# Altium schematic sheet CAN_MAX3051_NB2IND02.SchDoc: CAN Transceiver MAX3051
size A4; Organization: Altium Limited.; Address1: Level 3, 12a Rodborough Rd; Address2: Frenchs Forest 2086; Address3: NSW; Address4: AUSTRALIA; Revision: 6; SheetNumber: 1; SheetTotal: 100
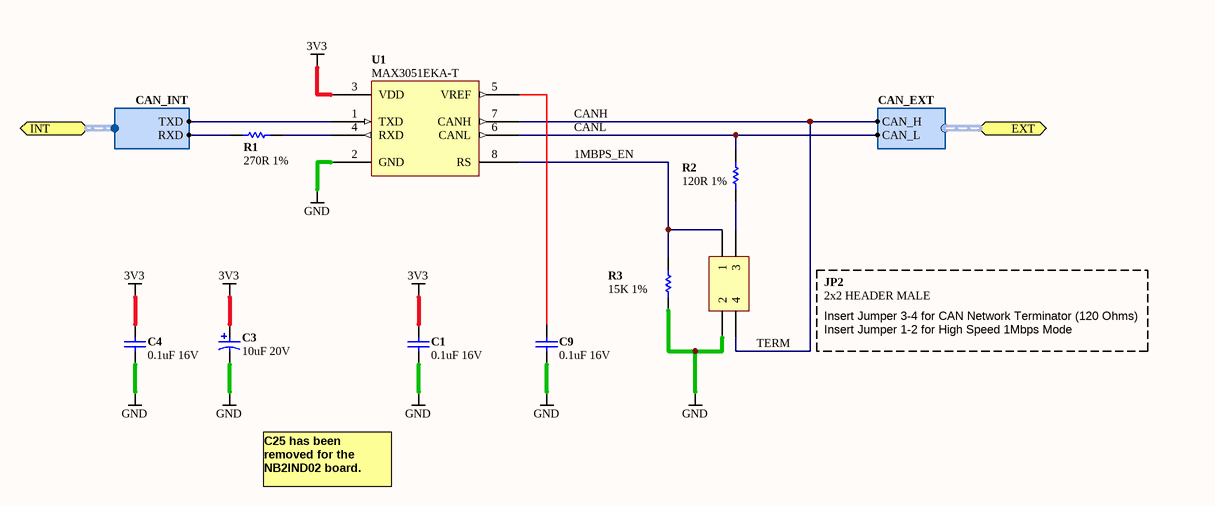
[diagram p0: CAN_MAX3051_NB2IND02.SchDoc]

## Parts
C1  0.1uF 16V  [CAPC1005-STAR]
C3  10uF 20V  [CAPC3528-STAR]
C4  0.1uF 16V  [CAPC1005-STAR]
C9  0.1uF 16V  [CAPC1005-STAR]
JP2  2x2 HEADER MALE  [HDR2X2]
R1  270R 1%  [RESC1005-STAR]
R2  120R 1%  [RESC1005-STAR]
R3  15K 1%  [RESC1005-STAR]
U1  MAX3051EKA-T  [SOT65P280-8]

## Ports
EXT (harness CAN_EXT), INT (harness CAN_INT)

## Harnesses
CAN_INT: TXD, RXD
CAN_EXT: CAN_H, CAN_L

## Nets
3V3: C1.1 C3.1 C4.1 U1.3(VDD)
GND: C1.2 C3.2 C4.2 C9.2 JP2.2 R3.1 U1.2(GND)
1MBPS_EN: JP2.1 R3.2 U1.8(RS)
CANH: JP2.4 U1.7(CANH) ; port EXT.CAN_H  [also labelled TERM]
CANL: R2.2 U1.6(CANL) ; port EXT.CAN_L
NetC9_1: C9.1 U1.5(VREF)
NetJP2_3: JP2.3 R2.1
NetR1_1: R1.1 ; port INT.RXD
NetR1_2: R1.2 U1.4(RXD)
NetU1_1: U1.1(TXD) ; port INT.TXD

## Notes on the sheet
- Insert Jumper 1-2 for High Speed 1Mbps Mode
- Insert Jumper 3-4 for CAN Network Terminator (120 Ohms)
- C25 has been removed for the NB2IND02 board.
- Sheet Title
- Project Title
- Size:
- Date:
- A4
- Assy:
- Time:
- Revision:
- Sheet
- of
- File:

## Library data of the parts
C1 C4 C9 = D-101-0080: Capacitor, Ceramic, 0.1uF 10% 16V 0402 (1005) X7R; Polarity: Non-Polarized; Category: Capacitor; Capacitance: 0.1 uF; Dielectric: X7R; Mounting Technology: Surface Mount; Rated Voltage: 16 V; Status: Production; Technology: Ceramic; Tolerance: 10 %
C3 = D-101-0007: Capacitor, Tantalum, 10uF 10% 20V MCCT-B (3528); Polarity: Polarized; Category: Capacitor; Capacitance: 10 uF; Mounting Technology: Surface Mount; Rated Voltage: 20 V; Status: Production; Technology: Tantalum; Tolerance: 10 %
JP2 = D-300-0019: Header IDC, 2 x 2 Pin Vertical 2.54mm Pitch (Non-Boxed, Male); Max Current: 3 A; Category: Connector; Connector type: Header; Mounting Technology: Through-Hole; Pin Count: 4; Status: Production
R1 = D-100-0111: Resistor, 270R 1% 0402 (1005); Power Rating: 63 mW; Category: Resistor; Mounting Technology: Surface Mount; Resistance: 270 R; Status: Production; Tolerance: 1 %
R2 = D-100-0126: Resistor, 120R 1% 0402 (1005); Power Rating: 63 mW; Category: Resistor; Mounting Technology: Surface Mount; Resistance: 120 R; Status: Production; Tolerance: 1 %
R3 = D-100-0125: Resistor, 15K 1% 0402 (1005); Power Rating: 63 mW; Category: Resistor; Mounting Technology: Surface Mount; Resistance: 15 K; Status: Production; Tolerance: 1 %
U1 = D-221-0007: MAX3051EKA-T High-Speed CAN Transceiver SOT23-8; Category: IC-Communication; Comm Standard: CAN; Mounting Technology: Surface Mount; Status: Unreleased; Temperature Range: -40 TO +85